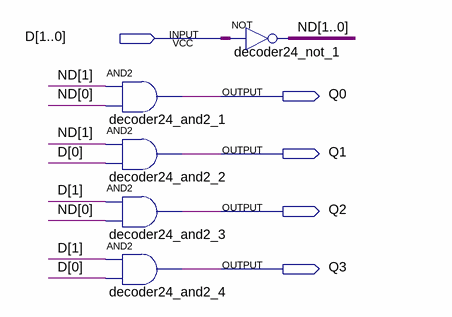
[diagram p0: schematic sheet]
// Quartus schematic decoder24.bdf as structural Verilog: 5 symbols, 5 pins
module decoder24 (
  input  [1:0] D,
  output Q0,
  output Q1,
  output Q2,
  output Q3
);

  wire [1:0] ND;

  and decoder24_and2_1 (Q0, ND[1], ND[0]);
  and decoder24_and2_2 (Q1, ND[1], D[0]);
  and decoder24_and2_3 (Q2, D[1], ND[0]);
  and decoder24_and2_4 (Q3, D[1], D[0]);
  assign ND = ~D;  // NOT decoder24_not_1, 2 bits wide
endmodule
